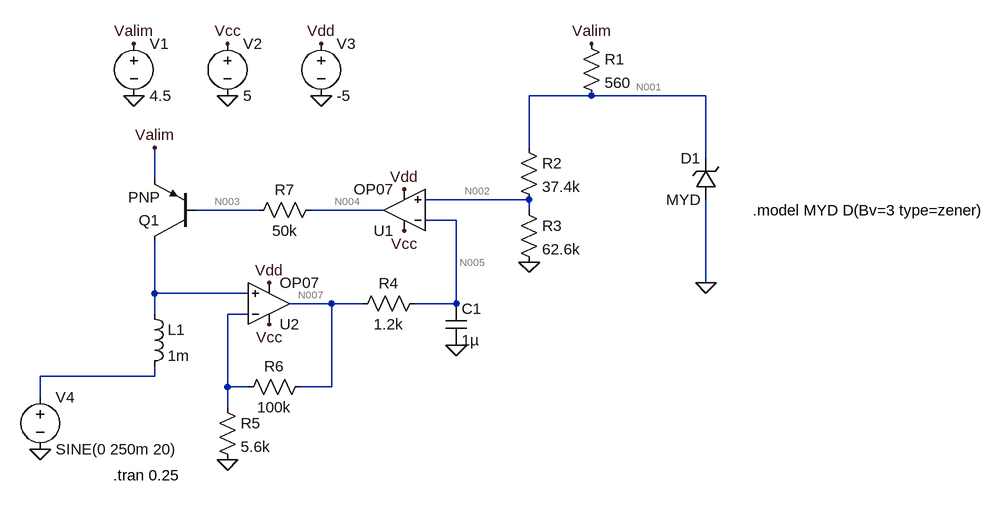
[diagram p0: schematic Draft3.asc]
Draft3.asc, the LTspice schematic file:
Version 4
SHEET 1 880 728
WIRE 240 128 144 128
WIRE 416 128 240 128
WIRE 144 208 144 128
WIRE 416 224 416 128
WIRE -432 256 -432 208
WIRE 144 288 -16 288
WIRE -272 304 -368 304
WIRE -80 304 -192 304
WIRE 144 304 144 288
WIRE 32 320 -16 320
WIRE 416 416 416 288
WIRE -432 432 -432 352
WIRE -288 432 -432 432
WIRE -160 448 -224 448
WIRE -112 448 -160 448
WIRE 32 448 32 320
WIRE 32 448 -32 448
WIRE -432 464 -432 432
WIRE -288 464 -320 464
WIRE -432 560 -432 544
WIRE -432 560 -608 560
WIRE -320 576 -320 464
WIRE -288 576 -320 576
WIRE -160 576 -160 448
WIRE -160 576 -208 576
WIRE -608 592 -608 560
WIRE -320 608 -320 576
FLAG 416 416 0
FLAG 144 384 0
FLAG 32 512 0
FLAG -320 688 0
FLAG -320 128 0
FLAG -176 128 0
FLAG -464 128 0
FLAG -320 48 Vcc
FLAG -48 336 Vcc
FLAG -256 480 Vcc
FLAG -464 48 Valim
FLAG 240 48 Valim
FLAG -176 48 Vdd
FLAG -48 272 Vdd
FLAG -256 416 Vdd
FLAG -608 672 0
FLAG -432 208 Valim
SYMBOL res 224 32 R0
SYMATTR InstName R1
SYMATTR Value 560
SYMBOL zener 432 288 R180
WINDOW 0 24 64 Left 2
WINDOW 3 24 0 Left 2
SYMATTR InstName D1
SYMATTR Value MYD
SYMBOL res 128 192 R0
SYMATTR InstName R2
SYMATTR Value 37.4k
SYMBOL res 128 288 R0
SYMATTR InstName R3
SYMATTR Value 62.6k
SYMBOL cap 16 448 R0
SYMATTR InstName C1
SYMATTR Value 1µ
SYMBOL res -16 432 R90
WINDOW 0 0 56 VBottom 2
WINDOW 3 32 56 VTop 2
SYMATTR InstName R4
SYMATTR Value 1.2k
SYMBOL OpAmps\\OP07 -48 368 R180
SYMATTR InstName U1
SYMBOL OpAmps\\OP07 -256 512 M180
SYMATTR InstName U2
SYMBOL res -336 592 R0
SYMATTR InstName R5
SYMATTR Value 5.6k
SYMBOL res -192 560 R90
WINDOW 0 0 56 VBottom 2
WINDOW 3 32 56 VTop 2
SYMATTR InstName R6
SYMATTR Value 100k
SYMBOL voltage -320 32 R0
WINDOW 123 0 0 Left 0
WINDOW 39 0 0 Left 0
SYMATTR InstName V2
SYMATTR Value 5
SYMBOL voltage -176 32 R0
WINDOW 123 0 0 Left 0
WINDOW 39 0 0 Left 0
SYMATTR InstName V3
SYMATTR Value -5
SYMBOL voltage -464 32 R0
WINDOW 123 0 0 Left 0
WINDOW 39 0 0 Left 0
SYMATTR InstName V1
SYMATTR Value 4.5
SYMBOL voltage -608 576 R0
WINDOW 123 0 0 Left 0
WINDOW 39 0 0 Left 0
SYMATTR InstName V4
SYMATTR Value SINE(0 250m 20)
SYMBOL res -176 288 R90
WINDOW 0 0 56 VBottom 2
WINDOW 3 32 56 VTop 2
SYMATTR InstName R7
SYMATTR Value 50k
SYMBOL ind -448 448 R0
SYMATTR InstName L1
SYMATTR Value 1m
SYMBOL pnp -368 352 R180
SYMATTR InstName Q1
TEXT 488 304 Left 2 !.model MYD D(Bv=3 type=zener)
TEXT -496 712 Left 2 !.tran 0.25

The netlist it stands for:
* Draft3.asc
R1 Valim N001 560
D1 0 N001 MYD
R2 N001 N002 37.4k
R3 N002 0 62.6k
C1 N005 0 1µ
R4 N005 N007 1.2k
XU1 N002 N005 Vcc Vdd N004 LT1001  ; OP07, pins In+ In- V+ V- OUT
XU2 N006 N008 Vcc Vdd N007 LT1001  ; OP07, pins In+ In- V+ V- OUT
R5 N008 0 5.6k
R6 N007 N008 100k
V2 Vcc 0 5
V3 Vdd 0 -5
V1 Valim 0 4.5
V4 N009 0 SINE(0 250m 20)
R7 N004 N003 50k
L1 N006 N009 1m
Q1 N006 N003 Valim 0 PNP
.model D D
.lib standard.dio
.model NPN NPN
.model PNP PNP
.lib standard.bjt
.model MYD D(Bv=3 type=zener)
.tran 0.25
.lib LTC.lib
.backanno
.end

* Results of the author's LTspice run, read from the files saved beside the schematic
* Operating Point, zero values left out:
*   V(valim) = 4.5 V
*   V(n001) = 3.433 V
*   V(n002) = 1.326 V
*   V(n005) = 42.16 mV
*   V(n007) = 29.77 nV
*   V(vcc) = 5 V
*   V(vdd) = -5 V
*   V(n004) = 4.07 V
*   V(n003) = 4.07 V
*   Ic(Q1) = -1.634 nA
*   Ib(Q1) = -12.66 pA
*   Ie(Q1) = 1.647 nA
*   I(D1) = -1.849 mA
*   I(L1) = 1.634 nA
*   I(R7) = -12.66 pA
*   I(R4) = 35.13 µA
*   I(R3) = 21.19 µA
*   I(R2) = 56.32 µA
*   I(R1) = 1.906 mA
*   I(V4) = 1.634 nA
*   I(V1) = -1.906 mA
*   I(V3) = 4.521 mA
*   I(V2) = -4.479 mA
*   Ix(u1:1) = 35.13 µA
*   Ix(u1:2) = -35.13 µA
*   Ix(u1:3) = 2.247 mA
*   Ix(u1:4) = -2.254 mA
*   Ix(u1:5) = 4.522 pA
*   Ix(u2:3) = 2.232 mA
*   Ix(u2:4) = -2.268 mA
*   Ix(u2:5) = 35.13 µA
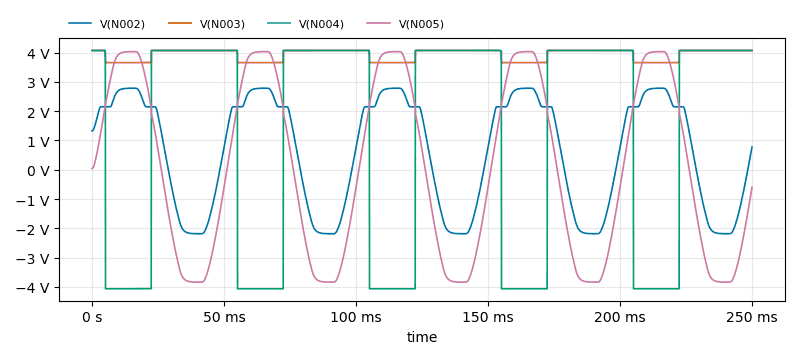
[diagram p1: Transient Analysis of Draft3.asc, plotted from the saved traces]
* Transient Analysis, 1 run:
*   V(N002): min -2.185 V, max 2.783 V, average 625 mV, rms 2.016 V, last 770.8 mV
*   V(N003): min 3.655 V, max 4.075 V, average 3.926 V, rms 3.931 V, last 4.07 V
*   V(N004): min -4.065 V, max 4.075 V, average 1.244 V, rms 4.066 V, last 4.07 V
*   V(N005): min -3.837 V, max 4.032 V, average 78.69 mV, rms 3.007 V, last -597.1 mV